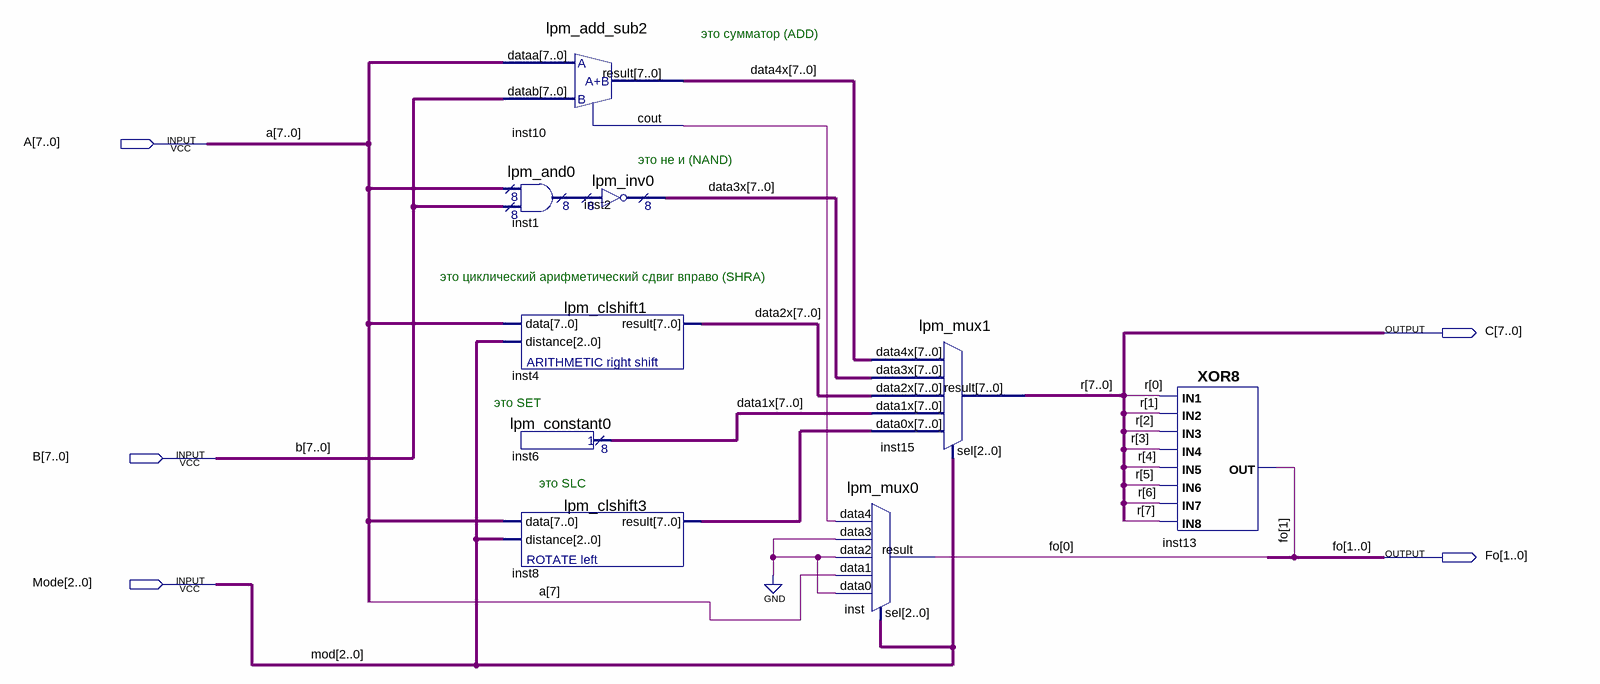
[diagram p0: schematic sheet]
// Quartus schematic ALU_49.bdf as structural Verilog: 9 symbols, 5 pins
module ALU_49 (
  input  [7:0] A,
  input  [7:0] B,
  input  [2:0] Mode,
  output [7:0] C,
  output [1:0] Fo
);

  wire inst10_cout;
  wire [7:0] data1x, data2x, data3x, data4x, inst1_result, inst8_result;

  lpm_add_sub2 inst10 (.dataa(A), .datab(B), .result(data4x), .cout(inst10_cout));
  lpm_and0 inst1 (.data0x(A), .data1x(B), .result(inst1_result));
  lpm_clshift1 inst4 (.data(A), .distance(Mode), .result(data2x));
  lpm_constant0 inst6 (.result(data1x));
  lpm_clshift3 inst8 (.data(A), .distance(Mode), .result(inst8_result));
  lpm_inv0 inst2 (.data(inst1_result), .result(data3x));
  lpm_mux1 inst15 (
    .data4x(data4x), .data3x(data3x), .data2x(data2x), .data1x(data1x), .data0x(inst8_result), .sel(Mode),
    .result(C));
  lpm_mux0 inst (
    .data4(inst10_cout), .data3(1'b0), .data2(1'b0), .data1(A[7]), .data0(1'b0), .sel(Mode), .result(Fo[0]));
  XOR8 inst13 (
    .IN8(C[7]), .IN1(C[0]), .IN7(C[6]), .IN6(C[5]), .IN5(C[4]), .IN4(C[3]), .IN3(C[2]), .IN2(C[1]),
    .OUT(Fo[1]));

  // Other names for the same wires on the sheet: mod[2:0] = Mode; r[7:0] = C

  // Notes on the sheet:
  //   это сумматор (ADD)
  //   это не и (NAND)
  //   это циклический арифметический сдвиг вправо (SHRA)
  //   это SET
  //   это SLC
endmodule
